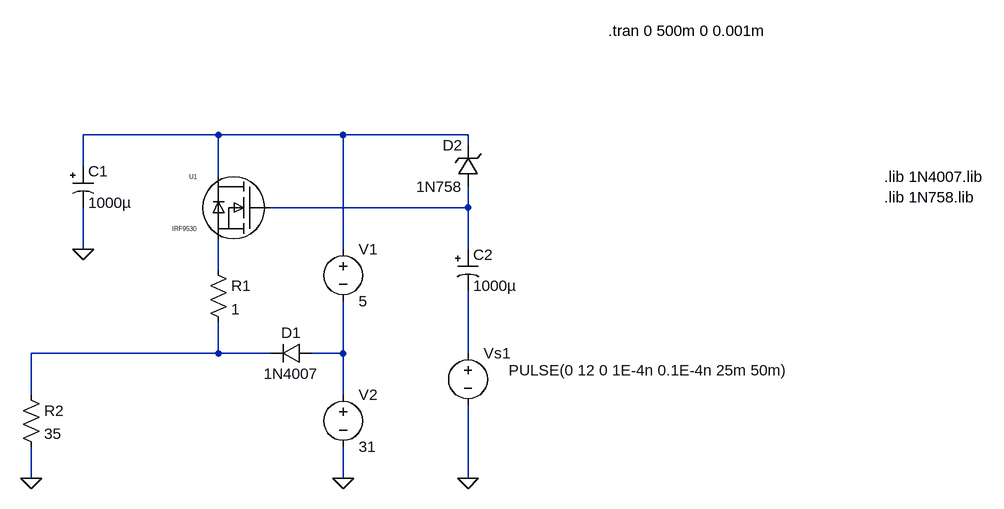
[diagram p0: schematic PSRR_circ.asc]
PSRR_circ.asc, the LTspice schematic file:
Version 4
SHEET 1 1176 680
WIRE -16 -128 -224 -128
WIRE 176 -128 -16 -128
WIRE 368 -128 176 -128
WIRE 368 -112 368 -128
WIRE -224 -80 -224 -128
WIRE -16 -64 -16 -128
WIRE 368 -16 368 -48
WIRE 368 -16 64 -16
WIRE -224 48 -224 -16
WIRE 176 48 176 -128
WIRE 368 48 368 -16
WIRE -16 80 -16 32
WIRE -16 208 -16 160
WIRE -16 208 -304 208
WIRE 64 208 -16 208
WIRE 176 208 176 128
WIRE 176 208 128 208
WIRE 368 208 368 112
WIRE -304 272 -304 208
WIRE 176 272 176 208
WIRE -304 400 -304 352
WIRE 176 400 176 352
WIRE 368 400 368 288
FLAG -224 48 0
FLAG 176 400 0
FLAG -304 400 0
FLAG 368 400 0
SYMBOL res -32 64 R0
SYMATTR InstName R1
SYMATTR Value 1
SYMBOL polcap -240 -80 R0
SYMATTR InstName C1
SYMATTR Value 1000µ
SYMBOL diode 128 192 R90
WINDOW 0 0 32 VBottom 2
WINDOW 3 32 32 VTop 2
SYMATTR InstName D1
SYMATTR Value 1N4007
SYMBOL zener 384 -48 R180
WINDOW 0 24 64 Left 2
WINDOW 3 24 0 Left 2
SYMATTR InstName D2
SYMATTR Value 1N758
SYMBOL polcap 352 48 R0
SYMATTR InstName C2
SYMATTR Value 1000µ
SYMBOL voltage 176 32 R0
WINDOW 123 0 0 Left 0
WINDOW 39 0 0 Left 0
SYMATTR InstName V1
SYMATTR Value 5
SYMBOL voltage 176 256 R0
WINDOW 123 0 0 Left 0
WINDOW 39 0 0 Left 0
SYMATTR InstName V2
SYMATTR Value 31
SYMBOL res -320 256 R0
SYMATTR InstName R2
SYMATTR Value 35
SYMBOL voltage 368 192 R0
WINDOW 39 0 0 Left 0
WINDOW 3 63 42 Left 2
SYMATTR Value PULSE(0 12 0 1E-4n 0.1E-4n 25m 50m)
SYMATTR Value2 AC 1
SYMATTR InstName Vs1
SYMBOL IRF9530 16 -16 M0
SYMATTR InstName U1
TEXT 584 -288 Left 2 !.tran 0 500m 0 0.001m
TEXT 1008 -64 Left 2 !.lib 1N4007.lib
TEXT 1008 -32 Left 2 !.lib 1N758.lib

The netlist it stands for:
* PSRR_circ.asc
R1 N003 N004 1
C1 N001 0 1000µ
D1 N005 N004 1N4007
D2 N002 N001 1N758
C2 N002 N006 1000µ
V1 N001 N005 5
V2 N005 0 31
R2 N004 0 35
Vs1 N006 0 PULSE(0 12 0 1E-4n 0.1E-4n 25m 50m) AC 1
XU1 N001 N002 N003 IRF9530  ; pins C G E
.model D D
.lib standard.dio
.tran 0 500m 0 0.001m
.lib 1N4007.lib
.lib 1N758.lib
.lib IRF9530.lib
.backanno
.end